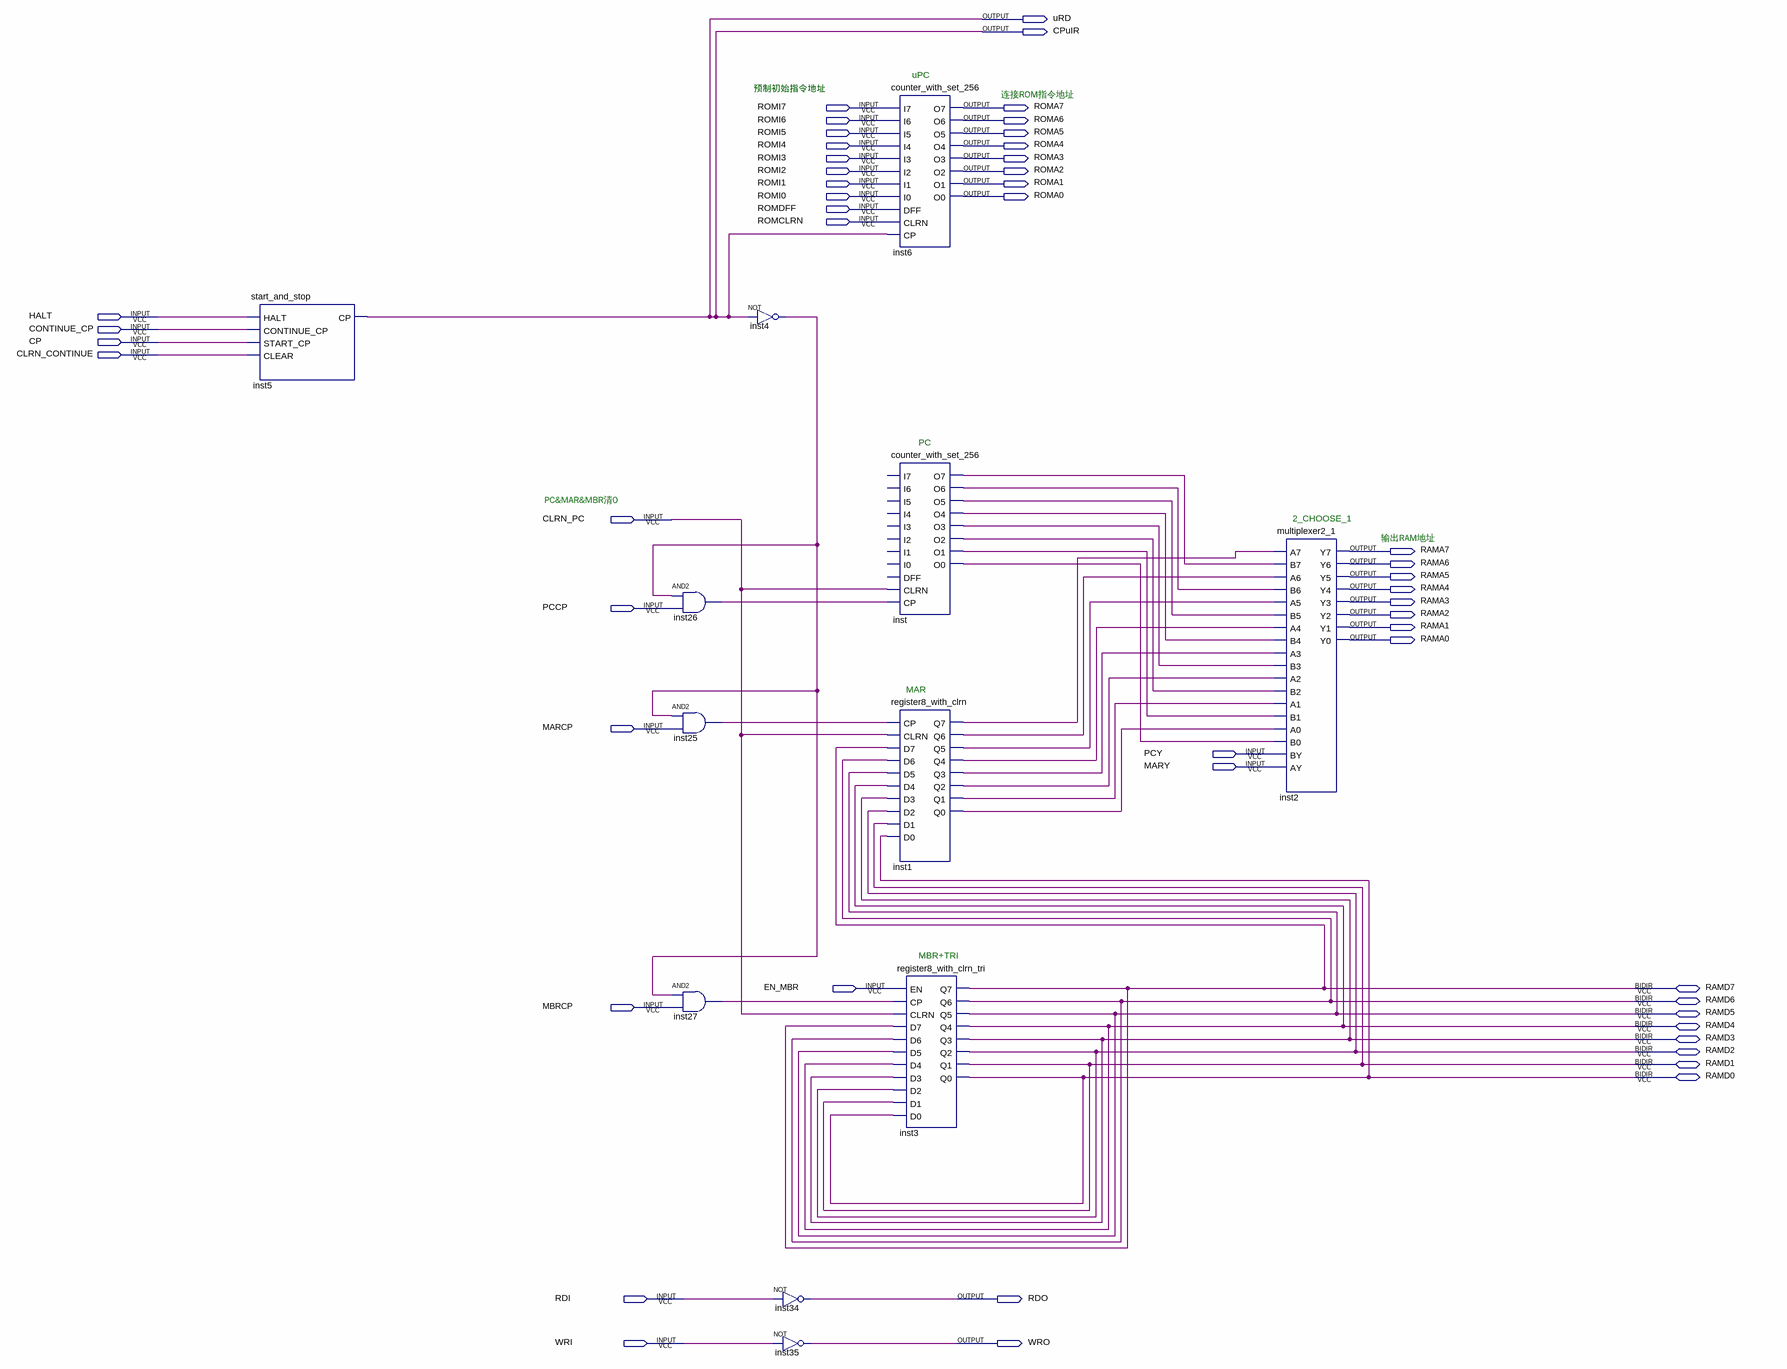
[diagram p0: schematic sheet]
// Quartus schematic fetch_system.bdf as structural Verilog: 12 symbols, 51 pins
module fetch_system (
  input  ROMI7,
  input  ROMI6,
  input  ROMI5,
  input  ROMI4,
  input  ROMI3,
  input  ROMI2,
  input  ROMI1,
  input  ROMI0,
  input  ROMDFF,
  input  ROMCLRN,
  input  HALT,
  input  CONTINUE_CP,
  input  CP,
  input  CLRN_CONTINUE,
  input  CLRN_PC,
  input  PCCP,
  input  MARCP,
  input  PCY,
  input  MARY,
  input  EN_MBR,
  input  MBRCP,
  input  RDI,
  input  WRI,
  inout  RAMD7,
  inout  RAMD6,
  inout  RAMD5,
  inout  RAMD4,
  inout  RAMD3,
  inout  RAMD2,
  inout  RAMD1,
  inout  RAMD0,
  output uRD,
  output CPuIR,
  output ROMA7,
  output ROMA6,
  output ROMA5,
  output ROMA4,
  output ROMA3,
  output ROMA2,
  output ROMA1,
  output ROMA0,
  output RAMA7,
  output RAMA6,
  output RAMA5,
  output RAMA4,
  output RAMA3,
  output RAMA2,
  output RAMA1,
  output RAMA0,
  output RDO,
  output WRO
);

  wire inst1_q0, inst1_q1, inst1_q2, inst1_q3, inst1_q4, inst1_q5, inst1_q6, inst1_q7, inst4_out, inst25_out,
       inst26_out, inst27_out, inst_o0, inst_o1, inst_o2, inst_o3, inst_o4, inst_o5, inst_o6, inst_o7;

  start_and_stop inst5 (.HALT(HALT), .CONTINUE_CP(CONTINUE_CP), .START_CP(CP), .CLEAR(CLRN_CONTINUE), .CP(CPuIR));
  and inst26 (inst26_out, inst4_out, PCCP);
  and inst25 (inst25_out, inst4_out, MARCP);
  and inst27 (inst27_out, inst4_out, MBRCP);
  not inst4 (inst4_out, CPuIR);
  not inst34 (RDO, RDI);
  not inst35 (WRO, WRI);
  counter_with_set_256 inst6 (
    .I7(ROMI7), .I6(ROMI6), .I5(ROMI5), .I4(ROMI4), .I3(ROMI3), .I2(ROMI2), .I1(ROMI1), .I0(ROMI0),
    .DFF(ROMDFF), .CLRN(ROMCLRN), .CP(CPuIR), .O7(ROMA7), .O6(ROMA6), .O5(ROMA5), .O4(ROMA4), .O3(ROMA3),
    .O2(ROMA2), .O1(ROMA1), .O0(ROMA0));
  counter_with_set_256 inst (
    .CLRN(CLRN_PC), .CP(inst26_out), .O7(inst_o7), .O6(inst_o6), .O5(inst_o5), .O4(inst_o4), .O3(inst_o3),
    .O2(inst_o2), .O1(inst_o1), .O0(inst_o0));  // open: I7, I6, I5, I4, I3, I2, I1, I0, DFF
  register8_with_clrn inst1 (
    .CP(inst25_out), .CLRN(CLRN_PC), .D7(RAMD7), .D6(RAMD6), .D5(RAMD5), .D4(RAMD4), .D3(RAMD3), .D2(RAMD2),
    .D1(RAMD1), .D0(RAMD0), .Q7(inst1_q7), .Q6(inst1_q6), .Q5(inst1_q5), .Q4(inst1_q4), .Q3(inst1_q3),
    .Q2(inst1_q2), .Q1(inst1_q1), .Q0(inst1_q0));
  register8_with_clrn_tri inst3 (
    .EN(EN_MBR), .CP(inst27_out), .CLRN(CLRN_PC), .D7(RAMD7), .D6(RAMD6), .D5(RAMD5), .D4(RAMD4), .D3(RAMD3),
    .D2(RAMD2), .D1(RAMD1), .D0(RAMD0), .Q7(RAMD7), .Q6(RAMD6), .Q5(RAMD5), .Q4(RAMD4), .Q3(RAMD3),
    .Q2(RAMD2), .Q1(RAMD1), .Q0(RAMD0));
  multiplexer2_1 inst2 (
    .A7(inst1_q7), .B7(inst_o7), .A6(inst1_q6), .B6(inst_o6), .A5(inst1_q5), .B5(inst_o5), .A4(inst1_q4),
    .B4(inst_o4), .A3(inst1_q3), .B3(inst_o3), .A2(inst1_q2), .B2(inst_o2), .A1(inst1_q1), .B1(inst_o1),
    .A0(inst1_q0), .B0(inst_o0), .BY(PCY), .AY(MARY), .Y7(RAMA7), .Y6(RAMA6), .Y5(RAMA5), .Y4(RAMA4),
    .Y3(RAMA3), .Y2(RAMA2), .Y1(RAMA1), .Y0(RAMA0));

  assign uRD = CPuIR;

  // Notes on the sheet:
  //   uPC
  //   预制初始指令地址
  //   连接ROM指令地址
  //   PC
  //   PC&MAR&MBR清0
  //   2_CHOOSE_1
  //   输出RAM地址
  //   MAR
  //   MBR+TRI
endmodule
